# Altium project PCB_3U_Kasli.PrjPCB (part 1 of 7)
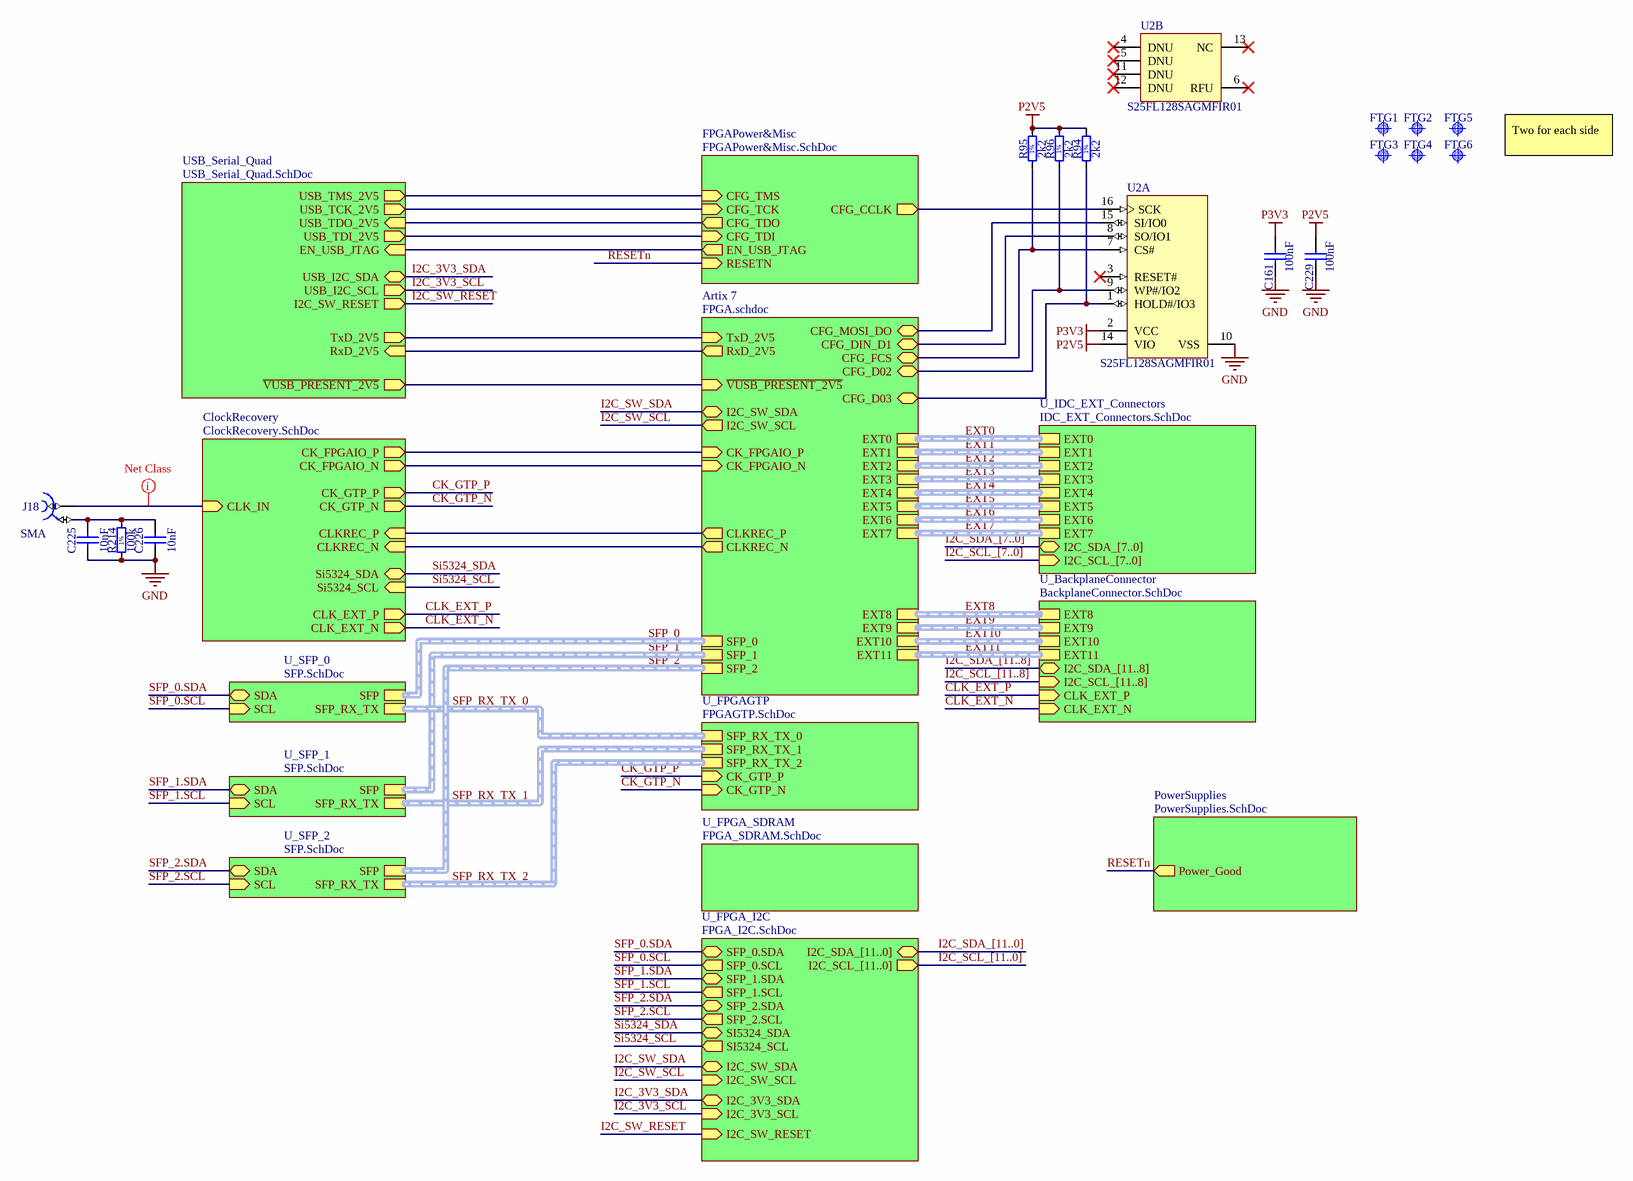
[diagram p0: TOP.SchDoc]
12 sheets, 669 parts. Net scope: hierarchical (ports join the sheet entries above them; power ports are global).
Board file: PCB_Kasli.PCBDOC
Sheets:
  TOP.SchDoc
    Artix 7 = FPGA.schdoc
    ClockRecovery = ClockRecovery.SchDoc
    PowerSupplies = PowerSupplies.SchDoc
    U_SFP_0 = SFP.SchDoc
    U_SFP_1 = SFP.SchDoc
    U_SFP_2 = SFP.SchDoc
    U_BackplaneConnector = BackplaneConnector.SchDoc
    FPGAPower&Misc = FPGAPower&Misc.SchDoc
    U_FPGAGTP = FPGAGTP.SchDoc
    U_FPGA_I2C = FPGA_I2C.SchDoc
    U_FPGA_SDRAM = FPGA_SDRAM.SchDoc
    U_IDC_EXT_Connectors = IDC_EXT_Connectors.SchDoc
    USB_Serial_Quad = USB_Serial_Quad.SchDoc

## Sheet TOP.SchDoc: =ProjectName
size 420 x 297 mm; Author: G.K.; CompanyName: WUT; DrawnBy: P.K.; Organization: WUT ISE; Address1: Warsaw Univeristy of Technology; Address2: Nowowiejska 15/19; DocumentNumber: 1; Revision: 1.0; SheetNumber: 1; SheetTotal: 12; EDA_Number: ARTIQ; Projet: ARTIQ/SINARA; ModifiedBy: -; CreateDate: XX/XX/XXXX; CheckedDate: -; Title2: TOP.SchDoc; DivGrp: ISE; Designer: G.K. and P.K.; ModifiedDate: -; ProjectName: ARTIQ/SINARA

### Parts
C161  100nF  [CAPC0603X33N]
C225  10nF  [CAPC1005X55N]
C226  10nF  [CAPC1005X55N]
C229  100nF  [CAPC0603X33N]
FTG1  Use only in PCB  [FIDUCIAL_TOP_C100-200]  (value not drawn)
FTG2  Use only in PCB  [FIDUCIAL_TOP_S100-200]  (value not drawn)
FTG3  Use only in PCB  [FIDUCIAL_TOP_C100-200]  (value not drawn)
FTG4  Use only in PCB  [FIDUCIAL_TOP_C100-200]  (value not drawn)
FTG5  Use only in PCB  [FIDUCIAL_TOP_C100-200]  (value not drawn)
FTG6  Use only in PCB  [FIDUCIAL_TOP_S100-200]  (value not drawn)
J18  SMA  [AMPHENOL_132203]
R94  2k2  [RESC1005X40N]
R95  2k2  [RESC1005X40N]
R96  2k2  [RESC1005X40N]
R214  100k  [RESC1005X40N]
U2  S25FL128SAGMFIR01  [SPSN-SOIC-16_N]  (parts A,B of 2)

### Sub-sheets
Artix 7 = FPGA.schdoc: EXT1 (harness ExtensionConnector), EXT2 (harness ExtensionConnector), EXT0 (harness ExtensionConnector), EXT3 (harness ExtensionConnector), EXT4 (harness ExtensionConnector), EXT5 (harness ExtensionConnector), EXT6 (harness ExtensionConnector), EXT7 (harness ExtensionConnector), EXT8 (harness ExtensionConnector), EXT9 (harness ExtensionConnector), EXT10 (harness ExtensionConnector), EXT11 (harness ExtensionConnector), CLKREC_P (out), CLKREC_N (out), CK_FPGAIO_P (in), CK_FPGAIO_N (in), SFP_0 (harness SFP), SFP_2 (harness SFP), SFP_1 (harness SFP), I2C_SW_SDA (bidir), I2C_SW_SCL (out), CFG_MOSI_DO (bidir), CFG_DIN_D1 (bidir), CFG_D02 (bidir), CFG_D03 (bidir), CFG_FCS (bidir), TxD_2V5 (in), RxD_2V5 (out), ~{VUSB_PRESENT_2V5} (in)
ClockRecovery = ClockRecovery.SchDoc: CLKREC_P (in), CLKREC_N (in), Si5324_SDA (bidir), Si5324_SCL (in), CK_GTP_P (out), CK_GTP_N (out), CK_FPGAIO_P (out), CK_FPGAIO_N (out), CLK_IN (in), CLK_EXT_P (out), CLK_EXT_N (out)
FPGAPower&Misc = FPGAPower&Misc.SchDoc: RESETN (in), CFG_CCLK (out), CFG_TMS (in), CFG_TCK (in), CFG_TDO (out), CFG_TDI (in), EN_USB_JTAG (out)
PowerSupplies = PowerSupplies.SchDoc: Power_Good (out)
U_BackplaneConnector = BackplaneConnector.SchDoc: EXT8 (harness ExtensionConnector), EXT9 (harness ExtensionConnector), EXT10 (harness ExtensionConnector), EXT11 (harness ExtensionConnector), I2C_SDA_[11..8] (bidir), I2C_SCL_[11..8] (in), CLK_EXT_P (in), CLK_EXT_N (in)
U_FPGA_I2C = FPGA_I2C.SchDoc: I2C_SDA_[11..0] (bidir), SFP_2.SDA (bidir), SFP_1.SDA (bidir), SFP_0.SDA (bidir), I2C_SW_SDA (bidir), I2C_SCL_[11..0] (out), SFP_0.SCL (out), SFP_1.SCL (out), SFP_2.SCL (out), SI5324_SDA (bidir), SI5324_SCL (out), I2C_SW_SCL (in), I2C_3V3_SCL (in), I2C_3V3_SDA (bidir), I2C_SW_RESET (in)
U_FPGA_SDRAM = FPGA_SDRAM.SchDoc: no entries
U_FPGAGTP = FPGAGTP.SchDoc: SFP_RX_TX_0 (harness SFP_RX_TX), SFP_RX_TX_1 (harness SFP_RX_TX), SFP_RX_TX_2 (harness SFP_RX_TX), CK_GTP_P (in), CK_GTP_N (in)
U_IDC_EXT_Connectors = IDC_EXT_Connectors.SchDoc: I2C_SDA_[7..0] (bidir), I2C_SCL_[7..0] (in), EXT0 (harness ExtensionConnector), EXT4 (harness ExtensionConnector), EXT2 (harness ExtensionConnector), EXT1 (harness ExtensionConnector), EXT3 (harness ExtensionConnector), EXT7 (harness ExtensionConnector), EXT6 (harness ExtensionConnector), EXT5 (harness ExtensionConnector)
U_SFP_0 = SFP.SchDoc: SDA (bidir), SCL (in), SFP (harness SFP), SFP_RX_TX (harness SFP_RX_TX)
U_SFP_1 = SFP.SchDoc: SDA (bidir), SCL (in), SFP (harness SFP), SFP_RX_TX (harness SFP_RX_TX)
U_SFP_2 = SFP.SchDoc: SDA (bidir), SCL (in), SFP (harness SFP), SFP_RX_TX (harness SFP_RX_TX)
USB_Serial_Quad = USB_Serial_Quad.SchDoc: USB_TDO_2V5 (in), RxD_2V5 (in), USB_TMS_2V5 (out), USB_TDI_2V5 (out), USB_TCK_2V5 (out), TxD_2V5 (out), EN_USB_JTAG (in), USB_I2C_SCL (out), USB_I2C_SDA (bidir), ~{VUSB_PRESENT_2V5} (out), I2C_SW_RESET (out)

### Nets
GND: C161.1 C225.1 C226.1 C229.1 R214.1 U2.10(VSS)
P2V5: C229.2 R94.2 R95.2 R96.2 U2.14(VIO)
P3V3: C161.2 U2.2(VCC)
~{VUSB_PRESENT_2V5}: sheet Artix 7/~{VUSB_PRESENT_2V5}, sheet USB_Serial_Quad/~{VUSB_PRESENT_2V5}
CFG_CCLK: U2.16(SCK) ; sheet FPGAPower&Misc/CFG_CCLK
CFG_D02: R96.1 U2.9(WP#/IO2) ; sheet Artix 7/CFG_D02
CFG_D03: R94.1 U2.1(HOLD#/IO3) ; sheet Artix 7/CFG_D03
CFG_DIN: U2.8(SO/IO1) ; sheet Artix 7/CFG_DIN_D1
CFG_FCS: R95.1 U2.7(CS#) ; sheet Artix 7/CFG_FCS
CFG_MOSI: U2.15(SI/IO0) ; sheet Artix 7/CFG_MOSI_DO
CFG_TCK: sheet FPGAPower&Misc/CFG_TCK, sheet USB_Serial_Quad/USB_TCK_2V5
CFG_TDI: sheet FPGAPower&Misc/CFG_TDI, sheet USB_Serial_Quad/USB_TDI_2V5
CFG_TDO: sheet FPGAPower&Misc/CFG_TDO, sheet USB_Serial_Quad/USB_TDO_2V5
CFG_TMS: sheet FPGAPower&Misc/CFG_TMS, sheet USB_Serial_Quad/USB_TMS_2V5
CK_FPGAIO_N: sheet Artix 7/CK_FPGAIO_N, sheet ClockRecovery/CK_FPGAIO_N
CK_FPGAIO_P: sheet Artix 7/CK_FPGAIO_P, sheet ClockRecovery/CK_FPGAIO_P
CK_GTP_N: sheet ClockRecovery/CK_GTP_N, sheet U_FPGAGTP/CK_GTP_N
CK_GTP_P: sheet ClockRecovery/CK_GTP_P, sheet U_FPGAGTP/CK_GTP_P
CLK_EXT_N: sheet ClockRecovery/CLK_EXT_N, sheet U_BackplaneConnector/CLK_EXT_N
CLK_EXT_P: sheet ClockRecovery/CLK_EXT_P, sheet U_BackplaneConnector/CLK_EXT_P
CLKREC_N: sheet Artix 7/CLKREC_N, sheet ClockRecovery/CLKREC_N
CLKREC_P: sheet Artix 7/CLKREC_P, sheet ClockRecovery/CLKREC_P
I2C_3V3_SCL: sheet U_FPGA_I2C/I2C_3V3_SCL, sheet USB_Serial_Quad/USB_I2C_SCL
I2C_3V3_SDA: sheet U_FPGA_I2C/I2C_3V3_SDA, sheet USB_Serial_Quad/USB_I2C_SDA
I2C_SW_RESET: sheet U_FPGA_I2C/I2C_SW_RESET, sheet USB_Serial_Quad/I2C_SW_RESET
I2C_SW_SCL: sheet Artix 7/I2C_SW_SCL, sheet U_FPGA_I2C/I2C_SW_SCL
I2C_SW_SDA: sheet Artix 7/I2C_SW_SDA, sheet U_FPGA_I2C/I2C_SW_SDA
RESETn: sheet PowerSupplies/Power_Good, sheet FPGAPower&Misc/RESETN
RxD_2V5: sheet Artix 7/RxD_2V5, sheet USB_Serial_Quad/RxD_2V5
SFP_0.SCL: sheet U_SFP_0/SCL, sheet U_FPGA_I2C/SFP_0.SCL
SFP_0.SDA: sheet U_SFP_0/SDA, sheet U_FPGA_I2C/SFP_0.SDA
SFP_1.SCL: sheet U_SFP_1/SCL, sheet U_FPGA_I2C/SFP_1.SCL
SFP_1.SDA: sheet U_SFP_1/SDA, sheet U_FPGA_I2C/SFP_1.SDA
SFP_2.SCL: sheet U_SFP_2/SCL, sheet U_FPGA_I2C/SFP_2.SCL
SFP_2.SDA: sheet U_SFP_2/SDA, sheet U_FPGA_I2C/SFP_2.SDA
Si5324_SCL: sheet ClockRecovery/Si5324_SCL, sheet U_FPGA_I2C/SI5324_SCL
Si5324_SDA: sheet ClockRecovery/Si5324_SDA, sheet U_FPGA_I2C/SI5324_SDA
TxD_2V5: sheet Artix 7/TxD_2V5, sheet USB_Serial_Quad/TxD_2V5
NetC53_2: sheet FPGAPower&Misc/EN_USB_JTAG, sheet USB_Serial_Quad/EN_USB_JTAG
NetC225_2: C225.2 C226.2 J18.2 R214.2
NetC228_1: J18.1 ; sheet ClockRecovery/CLK_IN

Not connected (* = marked no-connect by the designer): U2 3(RESET#)* 4(DNU)* 5(DNU)* 6(RFU)* 11(DNU)* 12(DNU)* 13(NC)*

### Buses and harness runs
bus I2C_SCL_[7..0] = sheet U_IDC_EXT_Connectors/I2C_SCL_[7..0]
bus I2C_SCL_[11..0] = sheet U_FPGA_I2C/I2C_SCL_[11..0]
bus I2C_SCL_[11..8] = sheet U_BackplaneConnector/I2C_SCL_[11..8]
bus I2C_SDA_[7..0] = sheet U_IDC_EXT_Connectors/I2C_SDA_[7..0]
bus I2C_SDA_[11..0] = sheet U_FPGA_I2C/I2C_SDA_[11..0]
bus I2C_SDA_[11..8] = sheet U_BackplaneConnector/I2C_SDA_[11..8]
harness EXT0 = sheet Artix 7/EXT0 = sheet U_IDC_EXT_Connectors/EXT0
harness EXT1 = sheet Artix 7/EXT1 = sheet U_IDC_EXT_Connectors/EXT1
harness EXT2 = sheet Artix 7/EXT2 = sheet U_IDC_EXT_Connectors/EXT2
harness EXT3 = sheet Artix 7/EXT3 = sheet U_IDC_EXT_Connectors/EXT3
harness EXT4 = sheet Artix 7/EXT4 = sheet U_IDC_EXT_Connectors/EXT4
harness EXT5 = sheet Artix 7/EXT5 = sheet U_IDC_EXT_Connectors/EXT5
harness EXT6 = sheet Artix 7/EXT6 = sheet U_IDC_EXT_Connectors/EXT6
harness EXT7 = sheet Artix 7/EXT7 = sheet U_IDC_EXT_Connectors/EXT7
harness EXT8 = sheet Artix 7/EXT8 = sheet U_BackplaneConnector/EXT8
harness EXT9 = sheet Artix 7/EXT9 = sheet U_BackplaneConnector/EXT9
harness EXT10 = sheet Artix 7/EXT10 = sheet U_BackplaneConnector/EXT10
harness EXT11 = sheet Artix 7/EXT11 = sheet U_BackplaneConnector/EXT11
harness SFP_0 = sheet Artix 7/SFP_0 = sheet U_SFP_0/SFP
harness SFP_1 = sheet Artix 7/SFP_1 = sheet U_SFP_1/SFP
harness SFP_2 = sheet Artix 7/SFP_2 = sheet U_SFP_2/SFP
harness SFP_RX_TX_0 = sheet U_FPGAGTP/SFP_RX_TX_0 = sheet U_SFP_0/SFP_RX_TX
harness SFP_RX_TX_1 = sheet U_FPGAGTP/SFP_RX_TX_1 = sheet U_SFP_1/SFP_RX_TX
harness SFP_RX_TX_2 = sheet U_FPGAGTP/SFP_RX_TX_2 = sheet U_SFP_2/SFP_RX_TX

### Layout directives
net class 50Ohm: NetC228_1

### Notes on the sheet
- Two for each side
- Project/Equipment
- Document
- Designer
- Drawn by
- Check.by
- File
- Last Mod.
- Print Date
- Sheet
- Size
- A3
- of
- Rev
- (in symbol R0402_2K2_1%_0.0625W_100PPM) 1%
- (in symbol R0402_100K_1%_0.0625W_100PPM) 1%

### Library data of the parts
C161 C229 = CC0201_100NF_6.3V_10%_X5R: Non-polarised capacitor; Part Description: SMD Multilayer Chip Ceramic Capacitor; Manufacturer: GENERIC; Manufacturer1 Part Number: 02016D104KAT2A; Voltage: 6.3V; TC: X5R; Tolerance: ±10%; Part Number: CC0201_100NF_6.3V_10%_X5R; Component Kind: Standard; Component Type: Standard; Pin Count: 2; Value: 100nF; Status: Not Recommended; Manufacturer Part Number: CC0201_100NF_6.3V_10%_X5R; Case: 0201; Mounted: Yes; Socket: No; SMD: Yes; Sense: No; Manufacturer1 Example: AVX; Manufacturer1 ComponentHeight: 0.33mm; HelpURL: \\cern.ch\dfs\Applications\Altium\Datasheets\CC0201_X5R_AVX.pdf; Author: CERN DEM JLC; CreateDate: 03.12.2007; LatestRevisionDate: 03.12.2007; ClassName: Artix
C225 C226 = CC0402_10NF_16V_10%_X7R: Non-polarised capacitor; Part Description: SMD Multilayer Chip Ceramic Capacitor; Manufacturer: GENERIC; Manufacturer1 Part Number: 223878715636; Voltage: 16V; TC: X7R; Tolerance: ±10%; Part Number: CC0402_10NF_16V_10%_X7R; Component Kind: Standard; Component Type: Standard; Pin Count: 2; Value: 10nF; Status: Not Recommended; Manufacturer Part Number: CC0402_10NF_16V_10%_X7R; Case: 0402; Mounted: Yes; Socket: No; SMD: Yes; Sense: No; Manufacturer1 Example: PHYCOMP; Manufacturer1 ComponentHeight: 0.55mm; HelpURL: \\cern.ch\dfs\Applications\Altium\Datasheets\CC0402_X7R_PHYCOMP.pdf; Author: CERN DEM JLC; CreateDate: 03.12.2007; LatestRevisionDate: 03.12.2007
FTG1 FTG3-FTG5 = FIDUCIAL_TARGET_C100-200: Fiducial Target; Part Description: Round Fiducial Target, Top Layer, 1.0mm, Top Solder 2.0mm, Keepout =2.0mm; Mounted: No; Part Number: FIDUCIAL_TARGET_C100-200; Component Kind: Standard (No BOM); Component Type: Standard (No BOM); Pin Count: 1; Family: Fiducial; Socket: No; SMD: Yes; Sense: No; Status: None; ComponentHeight: 0mm; HelpURL: Undefined; Author: CERN DEM JLC; CreateDate: 09.02.2010; LatestRevisionDate: 04.04.2012; PackageDescription: Round Fiducial Target, Top Layer, 1.0mm, Top Solder 2.0mm, Keepout =2.0mm
FTG2 FTG6 = FIDUCIAL_TARGET_S100-200: Fiducial Target; Part Description: Square Fiducial Target, Top Layer, 1.0mm, Top Solder 2.0mm, Keepout =2.0mm; Mounted: No; Part Number: FIDUCIAL_TARGET_S100-200; Component Kind: Standard (No BOM); Component Type: Standard (No BOM); Pin Count: 1; Family: Fiducial; Socket: No; SMD: Yes; Sense: No; Status: None; ComponentHeight: 0mm; HelpURL: Undefined; Author: CERN DEM JLC; CreateDate: 09.02.2010; LatestRevisionDate: 04.04.2012; PackageDescription: Square Fiducial Target, Top Layer, 1.0mm, Top Solder 2.0mm, Keepout =2.0mm
J18 = AMPHENOL_132203: Part Description: 50 Ohm Through Hole SMA Right Angle PCB Jack; Manufacturer Part Number: 132203; PressFit: No; Part Number: AMPHENOL_132203; Component Kind: Standard; Component Type: Standard; Pin Count: 5; Family: SMA; Mounted: Yes; Socket: No; SMD: No; Sense: No; Status: None; Manufacturer: AMPHENOL; ComponentHeight: 10.44mm; HelpURL: \\cern.ch\dfs\Applications\Altium\Datasheets\AMPHENOL_132203.pdf; Author: CERN DEM MR; CreateDate: 2016-10-06; LatestRevisionDate: 2016-10-06; ClassName: Connectors
R94-R96 = R0402_2K2_1%_0.0625W_100PPM: Resistor - 1%; Part Description: General Purpose Thick Film Chip Resistor; Manufacturer: GENERIC; Manufacturer1 Part Number: 232270672202L; TC: ±100ppm/°C; PressFit: No; Part Number: R0402_2K2_1%_0.0625W_100PPM; Component Kind: Standard; Component Type: Standard; Pin Count: 2; Value: 2k2; Status: Not Recommended; Power: 0.0625W; Tolerance: ±1%; Manufacturer Part Number: R0402_2K2_1%_0.0625W_100PPM; Case: 0402; Mounted: Yes; Sense: No; Socket: No; SMD: Yes; Manufacturer1 Example: YAGEO PHYCOMP; Manufacturer1 ComponentHeight: 0.4mm; HelpURL: \\cern.ch\dfs\Applications\Altium\Datasheets\R0402_Phycomp_RC0402.pdf; Author: CERN DEM JLC; CreateDate: 03.12.2007; LatestRevisionDate: 17.10.2012; ClassName: Artix
R214 = R0402_100K_1%_0.0625W_100PPM: Resistor - 1%; Part Description: General Purpose Thick Film Chip Resistor; Manufacturer: GENERIC; Manufacturer1 Part Number: 232270671004L; PressFit: No; TC: ±100ppm/°C; Part Number: R0402_100K_1%_0.0625W_100PPM; Component Kind: Standard; Component Type: Standard; Pin Count: 2; Value: 100k; Status: Not Recommended; Manufacturer Part Number: R0402_100K_1%_0.0625W_100PPM; Case: 0402; Mounted: Yes; Sense: No; Socket: No; SMD: Yes; Manufacturer1 Example: YAGEO PHYCOMP; Manufacturer1 ComponentHeight: 0.4mm; HelpURL: \\cern.ch\dfs\Applications\Altium\Datasheets\R0402_Phycomp_RC0402.pdf; Author: CERN DEM JLC; CreateDate: 03.12.2007; LatestRevisionDate: 17.10.2012; Power: 0.0625W; Tolerance: ±1%
U2 = CMP-1329-00021-1: MirrorBit Flash Non-Volatile Memory CMOS 3.0 Volt Core with Versatile I/O, Serial Peripheral Interface with Multi-I/O, 128 Mbit, 133 MHz, -40 to 85 degC, 16-Pin SO (SO3016), RoHS, Tube; Manufacturer: Spansion; OTP: 1024 B; VCC: 2.7 to 3.6 V; Speed: 133 MHz; PackageDescription: 16-Pin Wide Plastic Small Outline Package, Body 10.3 x 7.5 mm, Pitch 1.27 mm; ComponentLink2URL: http://www.spansion.com/Support/Datasheets/S25FL128S_256S_00.pdf; PartNumber: S25FL128SAGMFIR01; Packing: Tube; Density: 128 Mbit; Temperature Range: -40 to 85 degC; Mounting Technology: Surface Mount; RoHS: TRUE; DatasheetVersion: Rev. 08; ComponentLink2Description: Datasheet; ComponentLink3URL: http://www.spansion.com/Support/Datasheets/S25FL128S_256S_00.pdf; ComponentLink1Description: Manufacturer URL; ComponentLink1URL: http://www.spansion.com/Pages/Default.aspx; ComponentLink3Description: Package Specification

## Sheet FPGA.schdoc: =ProjectName
size 420 x 297 mm; Author: P.K.; CompanyName: WUT; DrawnBy: P.K.; Organization: WUT ISE; Address1: Warsaw Univeristy of Technology; Address2: Nowowiejska 15/19; DocumentNumber: 2; Revision: 1.1; SheetNumber: 2; SheetTotal: 12; EDA_Number: ARTIQ; Projet: ARTIQ/SINARA; ModifiedBy: -; CreateDate: XX/XX/XXXX; CheckedDate: -; Title2: FPGA.schdoc; DivGrp: ISE; Designer: P.K.; ModifiedDate: -; ProjectName: ARTIQ/SINARA
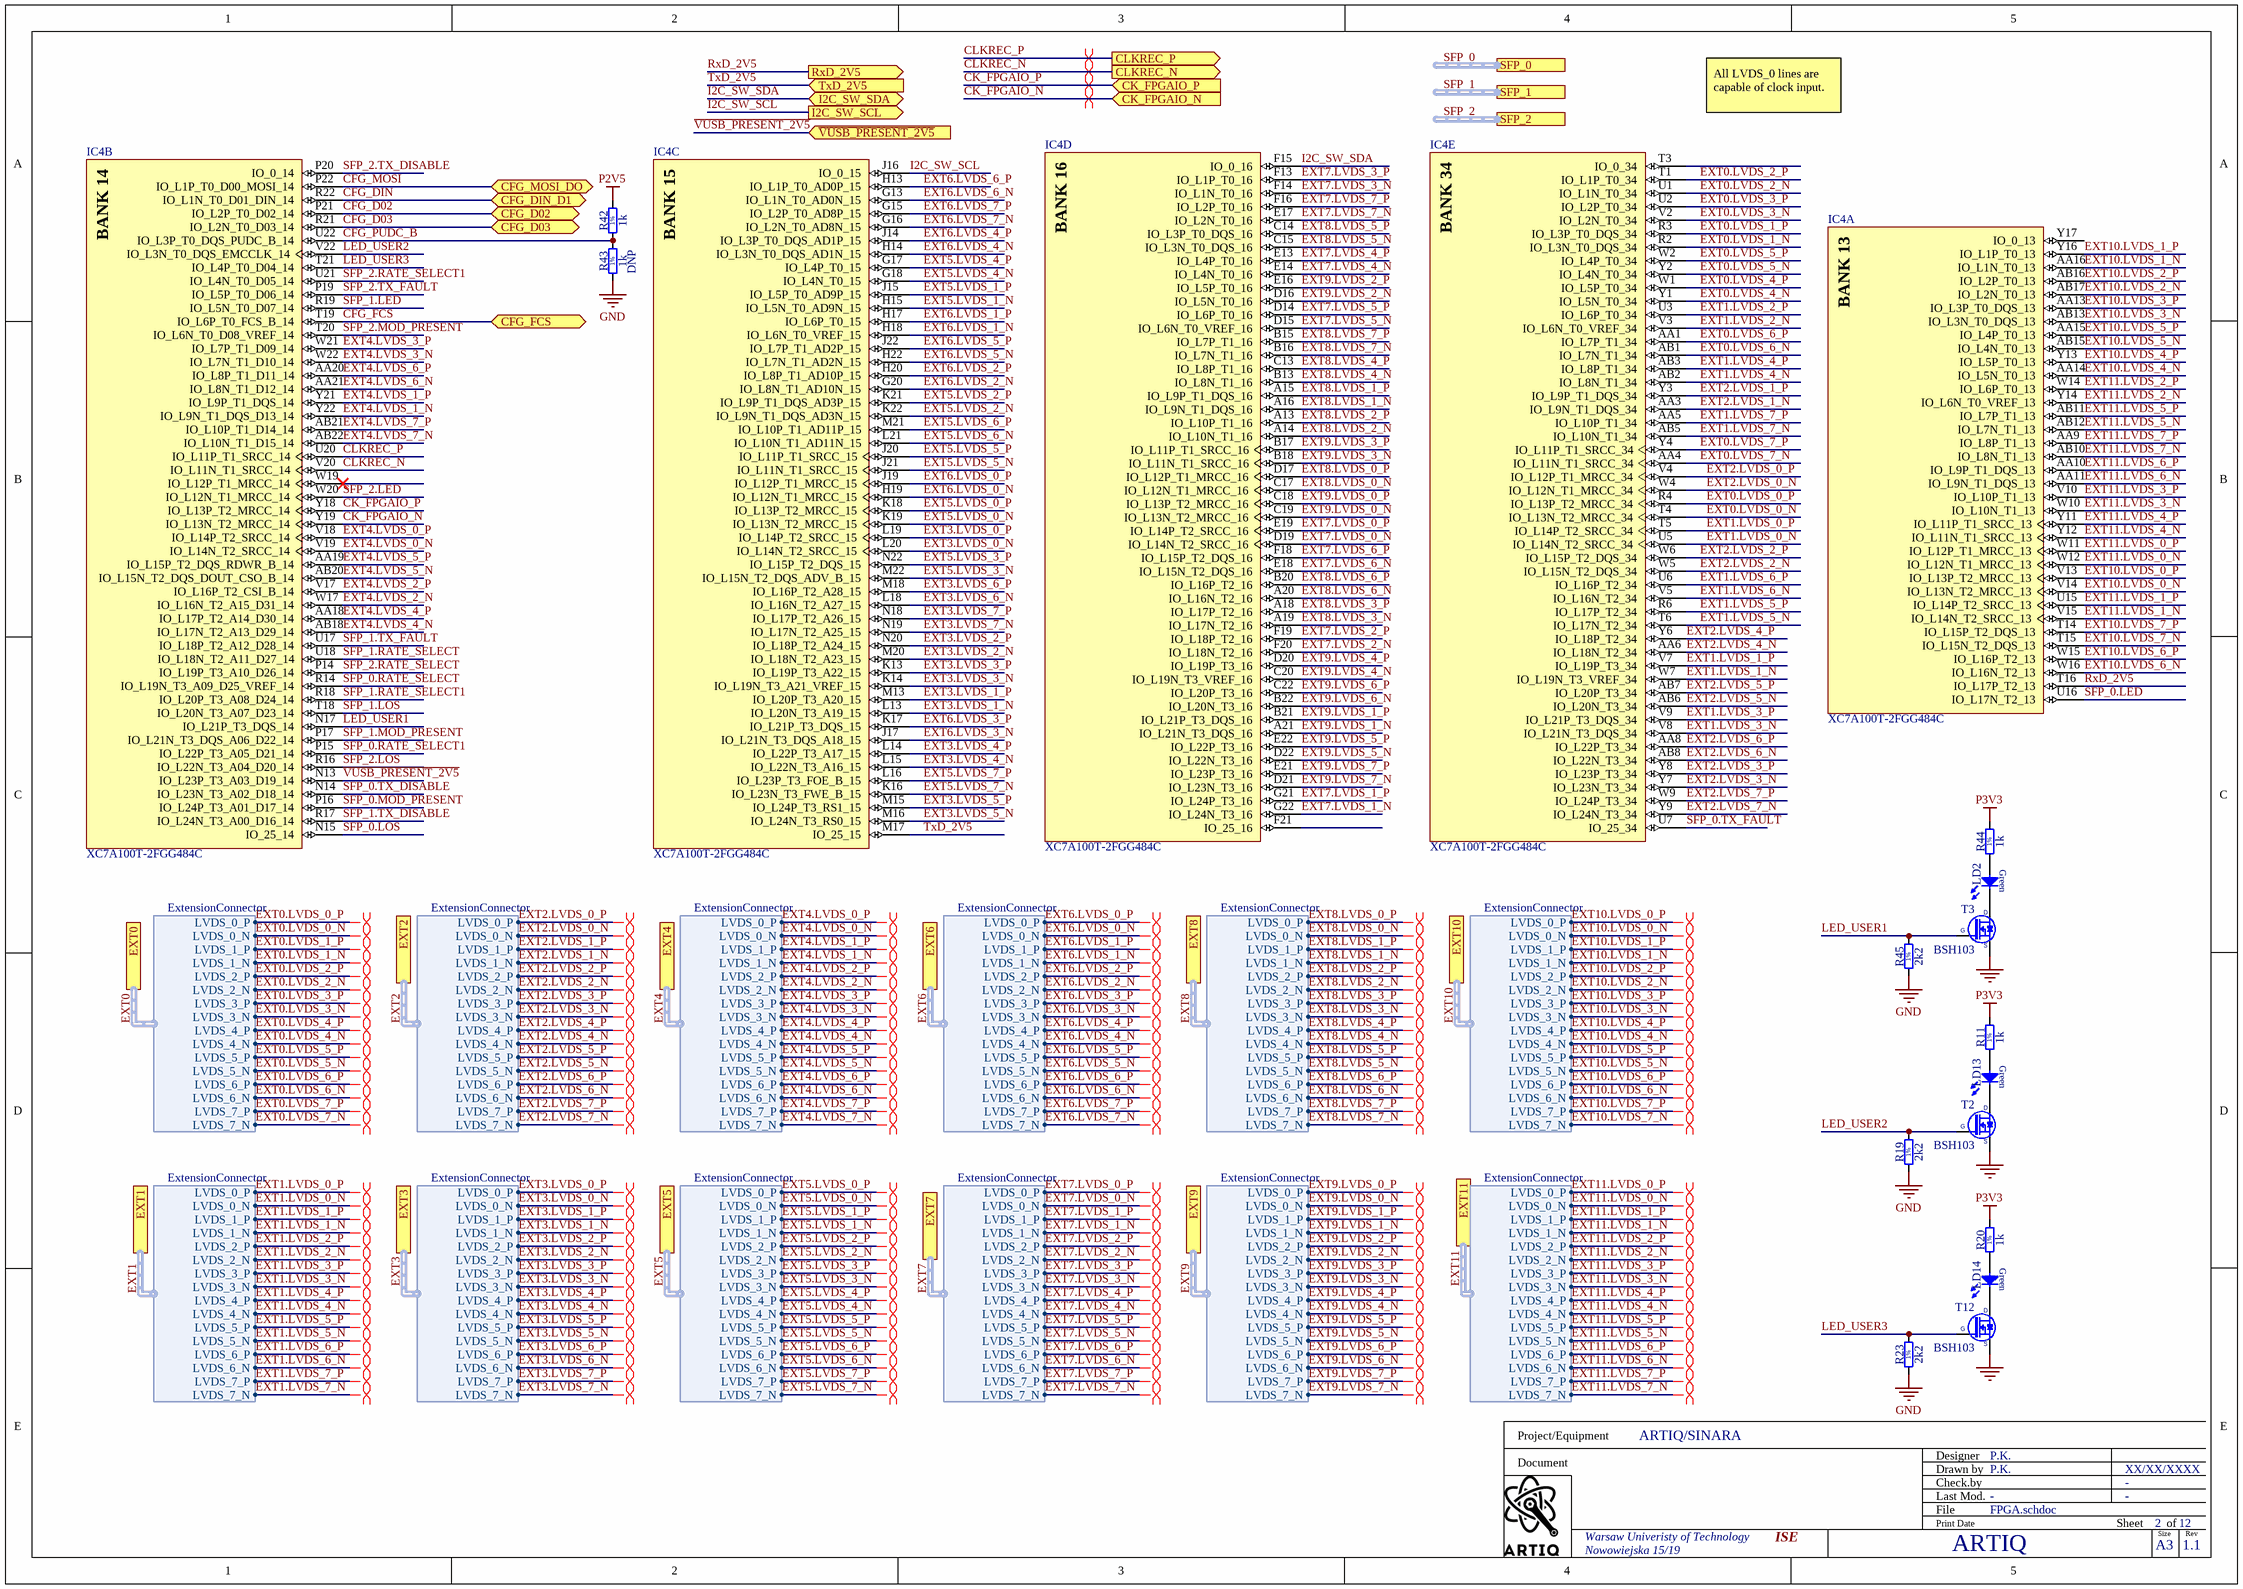
[diagram p1: FPGA.schdoc]

### Parts
IC4  XC7A100T-2FGG484C  [FGG484]  (parts A,B,C,D,E of 10)
LD2  (no value)  [LED_KINGBRIGHT_KPH-1608CGCK]
LD13  (no value)  [LED_KINGBRIGHT_KPH-1608CGCK]
LD14  (no value)  [LED_KINGBRIGHT_KPH-1608CGCK]
R11  1k  [RESC1005X40N]
R19  2k2  [RESC1005X40N]
R20  1k  [RESC1005X40N]
R23  2k2  [RESC1005X40N]
R42  1k  [RESC1005X40N]
R43  1k  [RESC1005X40N]
R44  1k  [RESC1005X40N]
R45  2k2  [RESC1005X40N]
T2  BSH103  [SOT95P230X110-3N]
T3  BSH103  [SOT95P230X110-3N]
T12  BSH103  [SOT95P230X110-3N]

### Ports
CFG_D02 (bidir), CFG_D03 (bidir), CFG_DIN_D1 (bidir), CFG_FCS (bidir), CFG_MOSI_DO (bidir), CK_FPGAIO_N (in), CK_FPGAIO_P (in), CLKREC_N (out), CLKREC_P (out), EXT0 (harness ExtensionConnector), EXT1 (harness ExtensionConnector), EXT2 (harness ExtensionConnector), EXT3 (harness ExtensionConnector), EXT4 (harness ExtensionConnector), EXT5 (harness ExtensionConnector), EXT6 (harness ExtensionConnector), EXT7 (harness ExtensionConnector), EXT8 (harness ExtensionConnector), EXT9 (harness ExtensionConnector), EXT10 (harness ExtensionConnector), EXT11 (harness ExtensionConnector), I2C_SW_SCL (out), I2C_SW_SDA (bidir), RxD_2V5 (out), SFP_0 (harness SFP), SFP_1 (harness SFP), SFP_2 (harness SFP), TxD_2V5 (in), ~{VUSB_PRESENT_2V5} (in)

### Harnesses
ExtensionConnector: LVDS_0_N, LVDS_0_P, LVDS_1_N, LVDS_1_P, LVDS_2_N, LVDS_2_P, LVDS_3_N, LVDS_3_P, LVDS_4_N, LVDS_4_P, LVDS_5_N, LVDS_5_P, LVDS_6_N, LVDS_6_P, LVDS_7_N, LVDS_7_P

### Nets
GND: R19.1 R23.1 R43.1 R45.1 T2.2(S) T3.2(S) T12.2(S)
P2V5: R42.2
P3V3: R11.2 R20.2 R44.2
~{VUSB_PRESENT_2V5}: IC4.N13(IO_L23P_T3_A03_D19_14) ; port ~{VUSB_PRESENT_2V5}
CFG_D02: IC4.P21(IO_L2P_T0_D02_14) ; port CFG_D02
CFG_D03: IC4.R21(IO_L2N_T0_D03_14) ; port CFG_D03
CFG_DIN: IC4.R22(IO_L1N_T0_D01_DIN_14) ; port CFG_DIN_D1
CFG_FCS: IC4.T19(IO_L6P_T0_FCS_B_14) ; port CFG_FCS
CFG_MOSI: IC4.P22(IO_L1P_T0_D00_MOSI_14) ; port CFG_MOSI_DO
CFG_PUDC_B: IC4.U22(IO_L3P_T0_DQS_PUDC_B_14) R42.1 R43.2
CK_FPGAIO_N: IC4.Y19(IO_L13N_T2_MRCC_14) ; port CK_FPGAIO_N
CK_FPGAIO_P: IC4.Y18(IO_L13P_T2_MRCC_14) ; port CK_FPGAIO_P
CLKREC_N: IC4.V20(IO_L11N_T1_SRCC_14) ; port CLKREC_N
CLKREC_P: IC4.U20(IO_L11P_T1_SRCC_14) ; port CLKREC_P
EXT0.LVDS_0_N: IC4.T4(IO_L13N_T2_MRCC_34) ; port EXT0.LVDS_0_N
EXT0.LVDS_0_P: IC4.R4(IO_L13P_T2_MRCC_34) ; port EXT0.LVDS_0_P
EXT0.LVDS_1_N: IC4.R2(IO_L3N_T0_DQS_34) ; port EXT0.LVDS_1_N
EXT0.LVDS_1_P: IC4.R3(IO_L3P_T0_DQS_34) ; port EXT0.LVDS_1_P
EXT0.LVDS_2_N: IC4.U1(IO_L1N_T0_34) ; port EXT0.LVDS_2_N
EXT0.LVDS_2_P: IC4.T1(IO_L1P_T0_34) ; port EXT0.LVDS_2_P
EXT0.LVDS_3_N: IC4.V2(IO_L2N_T0_34) ; port EXT0.LVDS_3_N
EXT0.LVDS_3_P: IC4.U2(IO_L2P_T0_34) ; port EXT0.LVDS_3_P
EXT0.LVDS_4_N: IC4.Y1(IO_L5N_T0_34) ; port EXT0.LVDS_4_N
EXT0.LVDS_4_P: IC4.W1(IO_L5P_T0_34) ; port EXT0.LVDS_4_P
EXT0.LVDS_5_N: IC4.Y2(IO_L4N_T0_34) ; port EXT0.LVDS_5_N
EXT0.LVDS_5_P: IC4.W2(IO_L4P_T0_34) ; port EXT0.LVDS_5_P
EXT0.LVDS_6_N: IC4.AB1(IO_L7N_T1_34) ; port EXT0.LVDS_6_N
EXT0.LVDS_6_P: IC4.AA1(IO_L7P_T1_34) ; port EXT0.LVDS_6_P
EXT0.LVDS_7_N: IC4.AA4(IO_L11N_T1_SRCC_34) ; port EXT0.LVDS_7_N
EXT0.LVDS_7_P: IC4.Y4(IO_L11P_T1_SRCC_34) ; port EXT0.LVDS_7_P
EXT1.LVDS_0_N: IC4.U5(IO_L14N_T2_SRCC_34) ; port EXT1.LVDS_0_N
EXT1.LVDS_0_P: IC4.T5(IO_L14P_T2_SRCC_34) ; port EXT1.LVDS_0_P
EXT1.LVDS_1_N: IC4.W7(IO_L19N_T3_VREF_34) ; port EXT1.LVDS_1_N
EXT1.LVDS_1_P: IC4.V7(IO_L19P_T3_34) ; port EXT1.LVDS_1_P
EXT1.LVDS_2_N: IC4.V3(IO_L6N_T0_VREF_34) ; port EXT1.LVDS_2_N
EXT1.LVDS_2_P: IC4.U3(IO_L6P_T0_34) ; port EXT1.LVDS_2_P
EXT1.LVDS_3_N: IC4.V8(IO_L21N_T3_DQS_34) ; port EXT1.LVDS_3_N
EXT1.LVDS_3_P: IC4.V9(IO_L21P_T3_DQS_34) ; port EXT1.LVDS_3_P
EXT1.LVDS_4_N: IC4.AB2(IO_L8N_T1_34) ; port EXT1.LVDS_4_N
EXT1.LVDS_4_P: IC4.AB3(IO_L8P_T1_34) ; port EXT1.LVDS_4_P
EXT1.LVDS_5_N: IC4.T6(IO_L17N_T2_34) ; port EXT1.LVDS_5_N
EXT1.LVDS_5_P: IC4.R6(IO_L17P_T2_34) ; port EXT1.LVDS_5_P
EXT1.LVDS_6_N: IC4.V5(IO_L16N_T2_34) ; port EXT1.LVDS_6_N
EXT1.LVDS_6_P: IC4.U6(IO_L16P_T2_34) ; port EXT1.LVDS_6_P
EXT1.LVDS_7_N: IC4.AB5(IO_L10N_T1_34) ; port EXT1.LVDS_7_N
EXT1.LVDS_7_P: IC4.AA5(IO_L10P_T1_34) ; port EXT1.LVDS_7_P
EXT2.LVDS_0_N: IC4.W4(IO_L12N_T1_MRCC_34) ; port EXT2.LVDS_0_N
EXT2.LVDS_0_P: IC4.V4(IO_L12P_T1_MRCC_34) ; port EXT2.LVDS_0_P
EXT2.LVDS_1_N: IC4.AA3(IO_L9N_T1_DQS_34) ; port EXT2.LVDS_1_N
EXT2.LVDS_1_P: IC4.Y3(IO_L9P_T1_DQS_34) ; port EXT2.LVDS_1_P
EXT2.LVDS_2_N: IC4.W5(IO_L15N_T2_DQS_34) ; port EXT2.LVDS_2_N
EXT2.LVDS_2_P: IC4.W6(IO_L15P_T2_DQS_34) ; port EXT2.LVDS_2_P
EXT2.LVDS_3_N: IC4.Y7(IO_L23N_T3_34) ; port EXT2.LVDS_3_N
EXT2.LVDS_3_P: IC4.Y8(IO_L23P_T3_34) ; port EXT2.LVDS_3_P
EXT2.LVDS_4_N: IC4.AA6(IO_L18N_T2_34) ; port EXT2.LVDS_4_N
EXT2.LVDS_4_P: IC4.Y6(IO_L18P_T2_34) ; port EXT2.LVDS_4_P
EXT2.LVDS_5_N: IC4.AB6(IO_L20N_T3_34) ; port EXT2.LVDS_5_N
EXT2.LVDS_5_P: IC4.AB7(IO_L20P_T3_34) ; port EXT2.LVDS_5_P
EXT2.LVDS_6_N: IC4.AB8(IO_L22N_T3_34) ; port EXT2.LVDS_6_N
EXT2.LVDS_6_P: IC4.AA8(IO_L22P_T3_34) ; port EXT2.LVDS_6_P
EXT2.LVDS_7_N: IC4.Y9(IO_L24N_T3_34) ; port EXT2.LVDS_7_N
EXT2.LVDS_7_P: IC4.W9(IO_L24P_T3_34) ; port EXT2.LVDS_7_P
EXT3.LVDS_0_N: IC4.L20(IO_L14N_T2_SRCC_15) ; port EXT3.LVDS_0_N
EXT3.LVDS_0_P: IC4.L19(IO_L14P_T2_SRCC_15) ; port EXT3.LVDS_0_P
EXT3.LVDS_1_N: IC4.L13(IO_L20N_T3_A19_15) ; port EXT3.LVDS_1_N
EXT3.LVDS_1_P: IC4.M13(IO_L20P_T3_A20_15) ; port EXT3.LVDS_1_P
EXT3.LVDS_2_N: IC4.M20(IO_L18N_T2_A23_15) ; port EXT3.LVDS_2_N
EXT3.LVDS_2_P: IC4.N20(IO_L18P_T2_A24_15) ; port EXT3.LVDS_2_P
EXT3.LVDS_3_N: IC4.K14(IO_L19N_T3_A21_VREF_15) ; port EXT3.LVDS_3_N
EXT3.LVDS_3_P: IC4.K13(IO_L19P_T3_A22_15) ; port EXT3.LVDS_3_P
EXT3.LVDS_4_N: IC4.L15(IO_L22N_T3_A16_15) ; port EXT3.LVDS_4_N
EXT3.LVDS_4_P: IC4.L14(IO_L22P_T3_A17_15) ; port EXT3.LVDS_4_P
EXT3.LVDS_5_N: IC4.M16(IO_L24N_T3_RS0_15) ; port EXT3.LVDS_5_N
EXT3.LVDS_5_P: IC4.M15(IO_L24P_T3_RS1_15) ; port EXT3.LVDS_5_P
EXT3.LVDS_6_N: IC4.L18(IO_L16N_T2_A27_15) ; port EXT3.LVDS_6_N
EXT3.LVDS_6_P: IC4.M18(IO_L16P_T2_A28_15) ; port EXT3.LVDS_6_P
EXT3.LVDS_7_N: IC4.N19(IO_L17N_T2_A25_15) ; port EXT3.LVDS_7_N
EXT3.LVDS_7_P: IC4.N18(IO_L17P_T2_A26_15) ; port EXT3.LVDS_7_P
EXT4.LVDS_0_N: IC4.V19(IO_L14N_T2_SRCC_14) ; port EXT4.LVDS_0_N
EXT4.LVDS_0_P: IC4.V18(IO_L14P_T2_SRCC_14) ; port EXT4.LVDS_0_P
EXT4.LVDS_1_N: IC4.Y22(IO_L9N_T1_DQS_D13_14) ; port EXT4.LVDS_1_N
EXT4.LVDS_1_P: IC4.Y21(IO_L9P_T1_DQS_14) ; port EXT4.LVDS_1_P
EXT4.LVDS_2_N: IC4.W17(IO_L16N_T2_A15_D31_14) ; port EXT4.LVDS_2_N
EXT4.LVDS_2_P: IC4.V17(IO_L16P_T2_CSI_B_14) ; port EXT4.LVDS_2_P
EXT4.LVDS_3_N: IC4.W22(IO_L7N_T1_D10_14) ; port EXT4.LVDS_3_N
EXT4.LVDS_3_P: IC4.W21(IO_L7P_T1_D09_14) ; port EXT4.LVDS_3_P
EXT4.LVDS_4_N: IC4.AB18(IO_L17N_T2_A13_D29_14) ; port EXT4.LVDS_4_N
EXT4.LVDS_4_P: IC4.AA18(IO_L17P_T2_A14_D30_14) ; port EXT4.LVDS_4_P
EXT4.LVDS_5_N: IC4.AB20(IO_L15N_T2_DQS_DOUT_CSO_B_14) ; port EXT4.LVDS_5_N
EXT4.LVDS_5_P: IC4.AA19(IO_L15P_T2_DQS_RDWR_B_14) ; port EXT4.LVDS_5_P
EXT4.LVDS_6_N: IC4.AA21(IO_L8N_T1_D12_14) ; port EXT4.LVDS_6_N
EXT4.LVDS_6_P: IC4.AA20(IO_L8P_T1_D11_14) ; port EXT4.LVDS_6_P
EXT4.LVDS_7_N: IC4.AB22(IO_L10N_T1_D15_14) ; port EXT4.LVDS_7_N
EXT4.LVDS_7_P: IC4.AB21(IO_L10P_T1_D14_14) ; port EXT4.LVDS_7_P
EXT5.LVDS_0_N: IC4.K19(IO_L13N_T2_MRCC_15) ; port EXT5.LVDS_0_N
EXT5.LVDS_0_P: IC4.K18(IO_L13P_T2_MRCC_15) ; port EXT5.LVDS_0_P
EXT5.LVDS_1_N: IC4.H15(IO_L5N_T0_AD9N_15) ; port EXT5.LVDS_1_N
EXT5.LVDS_1_P: IC4.J15(IO_L5P_T0_AD9P_15) ; port EXT5.LVDS_1_P
EXT5.LVDS_2_N: IC4.K22(IO_L9N_T1_DQS_AD3N_15) ; port EXT5.LVDS_2_N
EXT5.LVDS_2_P: IC4.K21(IO_L9P_T1_DQS_AD3P_15) ; port EXT5.LVDS_2_P
EXT5.LVDS_3_N: IC4.M22(IO_L15N_T2_DQS_ADV_B_15) ; port EXT5.LVDS_3_N
EXT5.LVDS_3_P: IC4.N22(IO_L15P_T2_DQS_15) ; port EXT5.LVDS_3_P
EXT5.LVDS_4_N: IC4.G18(IO_L4N_T0_15) ; port EXT5.LVDS_4_N
EXT5.LVDS_4_P: IC4.G17(IO_L4P_T0_15) ; port EXT5.LVDS_4_P
EXT5.LVDS_5_N: IC4.J21(IO_L11N_T1_SRCC_15) ; port EXT5.LVDS_5_N
EXT5.LVDS_5_P: IC4.J20(IO_L11P_T1_SRCC_15) ; port EXT5.LVDS_5_P
EXT5.LVDS_6_N: IC4.L21(IO_L10N_T1_AD11N_15) ; port EXT5.LVDS_6_N
EXT5.LVDS_6_P: IC4.M21(IO_L10P_T1_AD11P_15) ; port EXT5.LVDS_6_P
EXT5.LVDS_7_N: IC4.K16(IO_L23N_T3_FWE_B_15) ; port EXT5.LVDS_7_N
EXT5.LVDS_7_P: IC4.L16(IO_L23P_T3_FOE_B_15) ; port EXT5.LVDS_7_P
EXT6.LVDS_0_N: IC4.H19(IO_L12N_T1_MRCC_15) ; port EXT6.LVDS_0_N
EXT6.LVDS_0_P: IC4.J19(IO_L12P_T1_MRCC_15) ; port EXT6.LVDS_0_P
EXT6.LVDS_1_N: IC4.H18(IO_L6N_T0_VREF_15) ; port EXT6.LVDS_1_N
EXT6.LVDS_1_P: IC4.H17(IO_L6P_T0_15) ; port EXT6.LVDS_1_P
EXT6.LVDS_2_N: IC4.G20(IO_L8N_T1_AD10N_15) ; port EXT6.LVDS_2_N
EXT6.LVDS_2_P: IC4.H20(IO_L8P_T1_AD10P_15) ; port EXT6.LVDS_2_P
EXT6.LVDS_3_N: IC4.J17(IO_L21N_T3_DQS_A18_15) ; port EXT6.LVDS_3_N
EXT6.LVDS_3_P: IC4.K17(IO_L21P_T3_DQS_15) ; port EXT6.LVDS_3_P
EXT6.LVDS_4_N: IC4.H14(IO_L3N_T0_DQS_AD1N_15) ; port EXT6.LVDS_4_N
EXT6.LVDS_4_P: IC4.J14(IO_L3P_T0_DQS_AD1P_15) ; port EXT6.LVDS_4_P
EXT6.LVDS_5_N: IC4.H22(IO_L7N_T1_AD2N_15) ; port EXT6.LVDS_5_N
EXT6.LVDS_5_P: IC4.J22(IO_L7P_T1_AD2P_15) ; port EXT6.LVDS_5_P
EXT6.LVDS_6_N: IC4.G13(IO_L1N_T0_AD0N_15) ; port EXT6.LVDS_6_N
EXT6.LVDS_6_P: IC4.H13(IO_L1P_T0_AD0P_15) ; port EXT6.LVDS_6_P
EXT6.LVDS_7_N: IC4.G16(IO_L2N_T0_AD8N_15) ; port EXT6.LVDS_7_N
EXT6.LVDS_7_P: IC4.G15(IO_L2P_T0_AD8P_15) ; port EXT6.LVDS_7_P
EXT7.LVDS_0_N: IC4.D19(IO_L14N_T2_SRCC_16) ; port EXT7.LVDS_0_N
EXT7.LVDS_0_P: IC4.E19(IO_L14P_T2_SRCC_16) ; port EXT7.LVDS_0_P
EXT7.LVDS_1_N: IC4.G22(IO_L24N_T3_16) ; port EXT7.LVDS_1_N
EXT7.LVDS_1_P: IC4.G21(IO_L24P_T3_16) ; port EXT7.LVDS_1_P
EXT7.LVDS_2_N: IC4.F20(IO_L18N_T2_16) ; port EXT7.LVDS_2_N
EXT7.LVDS_2_P: IC4.F19(IO_L18P_T2_16) ; port EXT7.LVDS_2_P
EXT7.LVDS_3_N: IC4.F14(IO_L1N_T0_16) ; port EXT7.LVDS_3_N
EXT7.LVDS_3_P: IC4.F13(IO_L1P_T0_16) ; port EXT7.LVDS_3_P
EXT7.LVDS_4_N: IC4.E14(IO_L4N_T0_16) ; port EXT7.LVDS_4_N
EXT7.LVDS_4_P: IC4.E13(IO_L4P_T0_16) ; port EXT7.LVDS_4_P
EXT7.LVDS_5_N: IC4.D15(IO_L6N_T0_VREF_16) ; port EXT7.LVDS_5_N
EXT7.LVDS_5_P: IC4.D14(IO_L6P_T0_16) ; port EXT7.LVDS_5_P
EXT7.LVDS_6_N: IC4.E18(IO_L15N_T2_DQS_16) ; port EXT7.LVDS_6_N
EXT7.LVDS_6_P: IC4.F18(IO_L15P_T2_DQS_16) ; port EXT7.LVDS_6_P
EXT7.LVDS_7_N: IC4.E17(IO_L2N_T0_16) ; port EXT7.LVDS_7_N
EXT7.LVDS_7_P: IC4.F16(IO_L2P_T0_16) ; port EXT7.LVDS_7_P
EXT8.LVDS_0_N: IC4.C17(IO_L12N_T1_MRCC_16) ; port EXT8.LVDS_0_N
EXT8.LVDS_0_P: IC4.D17(IO_L12P_T1_MRCC_16) ; port EXT8.LVDS_0_P
EXT8.LVDS_1_N: IC4.A16(IO_L9N_T1_DQS_16) ; port EXT8.LVDS_1_N
EXT8.LVDS_1_P: IC4.A15(IO_L9P_T1_DQS_16) ; port EXT8.LVDS_1_P
EXT8.LVDS_2_N: IC4.A14(IO_L10N_T1_16) ; port EXT8.LVDS_2_N
EXT8.LVDS_2_P: IC4.A13(IO_L10P_T1_16) ; port EXT8.LVDS_2_P
EXT8.LVDS_3_N: IC4.A19(IO_L17N_T2_16) ; port EXT8.LVDS_3_N
EXT8.LVDS_3_P: IC4.A18(IO_L17P_T2_16) ; port EXT8.LVDS_3_P
EXT8.LVDS_4_N: IC4.B13(IO_L8N_T1_16) ; port EXT8.LVDS_4_N
EXT8.LVDS_4_P: IC4.C13(IO_L8P_T1_16) ; port EXT8.LVDS_4_P
EXT8.LVDS_5_N: IC4.C15(IO_L3N_T0_DQS_16) ; port EXT8.LVDS_5_N
EXT8.LVDS_5_P: IC4.C14(IO_L3P_T0_DQS_16) ; port EXT8.LVDS_5_P
EXT8.LVDS_6_N: IC4.A20(IO_L16N_T2_16) ; port EXT8.LVDS_6_N
EXT8.LVDS_6_P: IC4.B20(IO_L16P_T2_16) ; port EXT8.LVDS_6_P
EXT8.LVDS_7_N: IC4.B16(IO_L7N_T1_16) ; port EXT8.LVDS_7_N
EXT8.LVDS_7_P: IC4.B15(IO_L7P_T1_16) ; port EXT8.LVDS_7_P
EXT9.LVDS_0_N: IC4.C19(IO_L13N_T2_MRCC_16) ; port EXT9.LVDS_0_N
EXT9.LVDS_0_P: IC4.C18(IO_L13P_T2_MRCC_16) ; port EXT9.LVDS_0_P
EXT9.LVDS_1_N: IC4.A21(IO_L21N_T3_DQS_16) ; port EXT9.LVDS_1_N
EXT9.LVDS_1_P: IC4.B21(IO_L21P_T3_DQS_16) ; port EXT9.LVDS_1_P
EXT9.LVDS_2_N: IC4.D16(IO_L5N_T0_16) ; port EXT9.LVDS_2_N
EXT9.LVDS_2_P: IC4.E16(IO_L5P_T0_16) ; port EXT9.LVDS_2_P
EXT9.LVDS_3_N: IC4.B18(IO_L11N_T1_SRCC_16) ; port EXT9.LVDS_3_N
EXT9.LVDS_3_P: IC4.B17(IO_L11P_T1_SRCC_16) ; port EXT9.LVDS_3_P
EXT9.LVDS_4_N: IC4.C20(IO_L19N_T3_VREF_16) ; port EXT9.LVDS_4_N
EXT9.LVDS_4_P: IC4.D20(IO_L19P_T3_16) ; port EXT9.LVDS_4_P
EXT9.LVDS_5_N: IC4.D22(IO_L22N_T3_16) ; port EXT9.LVDS_5_N
EXT9.LVDS_5_P: IC4.E22(IO_L22P_T3_16) ; port EXT9.LVDS_5_P
EXT9.LVDS_6_N: IC4.B22(IO_L20N_T3_16) ; port EXT9.LVDS_6_N
EXT9.LVDS_6_P: IC4.C22(IO_L20P_T3_16) ; port EXT9.LVDS_6_P
EXT9.LVDS_7_N: IC4.D21(IO_L23N_T3_16) ; port EXT9.LVDS_7_N
EXT9.LVDS_7_P: IC4.E21(IO_L23P_T3_16) ; port EXT9.LVDS_7_P
EXT10.LVDS_0_N: IC4.V14(IO_L13N_T2_MRCC_13) ; port EXT10.LVDS_0_N
EXT10.LVDS_0_P: IC4.V13(IO_L13P_T2_MRCC_13) ; port EXT10.LVDS_0_P
EXT10.LVDS_1_N: IC4.AA16(IO_L1N_T0_13) ; port EXT10.LVDS_1_N
EXT10.LVDS_1_P: IC4.Y16(IO_L1P_T0_13) ; port EXT10.LVDS_1_P
EXT10.LVDS_2_N: IC4.AB17(IO_L2N_T0_13) ; port EXT10.LVDS_2_N
EXT10.LVDS_2_P: IC4.AB16(IO_L2P_T0_13) ; port EXT10.LVDS_2_P
EXT10.LVDS_3_N: IC4.AB13(IO_L3N_T0_DQS_13) ; port EXT10.LVDS_3_N
EXT10.LVDS_3_P: IC4.AA13(IO_L3P_T0_DQS_13) ; port EXT10.LVDS_3_P
EXT10.LVDS_4_N: IC4.AA14(IO_L5N_T0_13) ; port EXT10.LVDS_4_N
EXT10.LVDS_4_P: IC4.Y13(IO_L5P_T0_13) ; port EXT10.LVDS_4_P
EXT10.LVDS_5_N: IC4.AB15(IO_L4N_T0_13) ; port EXT10.LVDS_5_N
EXT10.LVDS_5_P: IC4.AA15(IO_L4P_T0_13) ; port EXT10.LVDS_5_P
EXT10.LVDS_6_N: IC4.W16(IO_L16N_T2_13) ; port EXT10.LVDS_6_N
EXT10.LVDS_6_P: IC4.W15(IO_L16P_T2_13) ; port EXT10.LVDS_6_P
EXT10.LVDS_7_N: IC4.T15(IO_L15N_T2_DQS_13) ; port EXT10.LVDS_7_N
EXT10.LVDS_7_P: IC4.T14(IO_L15P_T2_DQS_13) ; port EXT10.LVDS_7_P
EXT11.LVDS_0_N: IC4.W12(IO_L12N_T1_MRCC_13) ; port EXT11.LVDS_0_N
EXT11.LVDS_0_P: IC4.W11(IO_L12P_T1_MRCC_13) ; port EXT11.LVDS_0_P
EXT11.LVDS_1_N: IC4.V15(IO_L14N_T2_SRCC_13) ; port EXT11.LVDS_1_N
EXT11.LVDS_1_P: IC4.U15(IO_L14P_T2_SRCC_13) ; port EXT11.LVDS_1_P
EXT11.LVDS_2_N: IC4.Y14(IO_L6N_T0_VREF_13) ; port EXT11.LVDS_2_N
EXT11.LVDS_2_P: IC4.W14(IO_L6P_T0_13) ; port EXT11.LVDS_2_P
EXT11.LVDS_3_N: IC4.W10(IO_L10N_T1_13) ; port EXT11.LVDS_3_N
EXT11.LVDS_3_P: IC4.V10(IO_L10P_T1_13) ; port EXT11.LVDS_3_P
EXT11.LVDS_4_N: IC4.Y12(IO_L11N_T1_SRCC_13) ; port EXT11.LVDS_4_N
EXT11.LVDS_4_P: IC4.Y11(IO_L11P_T1_SRCC_13) ; port EXT11.LVDS_4_P
EXT11.LVDS_5_N: IC4.AB12(IO_L7N_T1_13) ; port EXT11.LVDS_5_N
EXT11.LVDS_5_P: IC4.AB11(IO_L7P_T1_13) ; port EXT11.LVDS_5_P
EXT11.LVDS_6_N: IC4.AA11(IO_L9N_T1_DQS_13) ; port EXT11.LVDS_6_N
EXT11.LVDS_6_P: IC4.AA10(IO_L9P_T1_DQS_13) ; port EXT11.LVDS_6_P
EXT11.LVDS_7_N: IC4.AB10(IO_L8N_T1_13) ; port EXT11.LVDS_7_N
EXT11.LVDS_7_P: IC4.AA9(IO_L8P_T1_13) ; port EXT11.LVDS_7_P
I2C_SW_SCL: IC4.J16(IO_0_15) ; port I2C_SW_SCL
I2C_SW_SDA: IC4.F15(IO_0_16) ; port I2C_SW_SDA
LED_USER1: IC4.N17(IO_L21P_T3_DQS_14) R45.2 T3.1(G)
LED_USER2: IC4.V22(IO_L3N_T0_DQS_EMCCLK_14) R19.2 T2.1(G)
LED_USER3: IC4.T21(IO_L4P_T0_D04_14) R23.2 T12.1(G)
RxD_2V5: IC4.T16(IO_L17P_T2_13) ; port RxD_2V5
SFP_0.LED: IC4.U16(IO_L17N_T2_13)
SFP_0.LOS: IC4.N15(IO_25_14)
SFP_0.MOD_PRESENT: IC4.P16(IO_L24P_T3_A01_D17_14)
SFP_0.RATE_SELECT: IC4.R14(IO_L19N_T3_A09_D25_VREF_14)
SFP_0.RATE_SELECT1: IC4.P15(IO_L22P_T3_A05_D21_14)
SFP_0.TX_DISABLE: IC4.N14(IO_L23N_T3_A02_D18_14)
SFP_0.TX_FAULT: IC4.U7(IO_25_34)
SFP_1.LED: IC4.R19(IO_L5N_T0_D07_14)
SFP_1.LOS: IC4.T18(IO_L20N_T3_A07_D23_14)
SFP_1.MOD_PRESENT: IC4.P17(IO_L21N_T3_DQS_A06_D22_14)
SFP_1.RATE_SELECT: IC4.U18(IO_L18N_T2_A11_D27_14)
SFP_1.RATE_SELECT1: IC4.R18(IO_L20P_T3_A08_D24_14)
SFP_1.TX_DISABLE: IC4.R17(IO_L24N_T3_A00_D16_14)
SFP_1.TX_FAULT: IC4.U17(IO_L18P_T2_A12_D28_14)
SFP_2.LED: IC4.W20(IO_L12N_T1_MRCC_14)
SFP_2.LOS: IC4.R16(IO_L22N_T3_A04_D20_14)
SFP_2.MOD_PRESENT: IC4.T20(IO_L6N_T0_D08_VREF_14)
SFP_2.RATE_SELECT: IC4.P14(IO_L19P_T3_A10_D26_14)
SFP_2.RATE_SELECT1: IC4.U21(IO_L4N_T0_D05_14)
SFP_2.TX_DISABLE: IC4.P20(IO_0_14)
SFP_2.TX_FAULT: IC4.P19(IO_L5P_T0_D06_14)
TxD_2V5: IC4.M17(IO_25_15) ; port TxD_2V5
NetLD2_1: LD2.1(A) R44.1
NetLD2_2: LD2.2(C) T3.3(D)
NetLD13_1: LD13.1(A) R11.1
NetLD13_2: LD13.2(C) T2.3(D)
NetLD14_1: LD14.1(A) R20.1
NetLD14_2: LD14.2(C) T12.3(D)

Not connected (* = marked no-connect by the designer): IC4 F21(IO_25_16) T3(IO_0_34) W19(IO_L12P_T1_MRCC_14)* Y17(IO_0_13)

### Buses and harness runs
harness EXT0 = port EXT0
harness EXT1 = port EXT1
harness EXT2 = port EXT2
harness EXT3 = port EXT3
harness EXT4 = port EXT4
harness EXT5 = port EXT5
harness EXT6 = port EXT6
harness EXT7 = port EXT7
harness EXT8 = port EXT8
harness EXT9 = port EXT9
harness EXT10 = port EXT10
harness EXT11 = port EXT11
harness SFP_0 = port SFP_0
harness SFP_1 = port SFP_1
harness SFP_2 = port SFP_2

### Layout directives
differential pair: CK_FPGAIO_N, CK_FPGAIO_P, CLKREC_N, CLKREC_P, EXT0.LVDS_0_N, EXT0.LVDS_1_N, EXT0.LVDS_1_P, EXT0.LVDS_2_N, EXT0.LVDS_2_P, EXT0.LVDS_3_N, EXT0.LVDS_3_P, EXT0.LVDS_4_N, EXT0.LVDS_4_P, EXT0.LVDS_5_N, EXT0.LVDS_5_P, EXT0.LVDS_6_N, EXT0.LVDS_6_P, EXT0.LVDS_7_N, EXT0.LVDS_7_P, EXT1.LVDS_0_N, EXT1.LVDS_0_P, EXT1.LVDS_1_N, EXT1.LVDS_1_P, EXT1.LVDS_2_N, EXT1.LVDS_2_P, EXT1.LVDS_3_N, EXT1.LVDS_3_P, EXT1.LVDS_4_N, EXT1.LVDS_4_P, EXT1.LVDS_5_N, EXT1.LVDS_5_P, EXT1.LVDS_6_N, EXT1.LVDS_6_P, EXT1.LVDS_7_N, EXT1.LVDS_7_P, EXT2.LVDS_0_N, EXT2.LVDS_0_P, EXT2.LVDS_1_N, EXT2.LVDS_1_P, EXT2.LVDS_2_N, EXT2.LVDS_2_P, EXT2.LVDS_3_N, EXT2.LVDS_3_P, EXT2.LVDS_4_N, EXT2.LVDS_4_P, EXT2.LVDS_5_N, EXT2.LVDS_5_P, EXT2.LVDS_6_N, EXT2.LVDS_6_P, EXT2.LVDS_7_N, EXT2.LVDS_7_P, EXT3.LVDS_0_N, EXT3.LVDS_0_P, EXT3.LVDS_1_N, EXT3.LVDS_1_P, EXT3.LVDS_2_N, EXT3.LVDS_2_P, EXT3.LVDS_3_N, EXT3.LVDS_3_P, EXT3.LVDS_4_N, EXT3.LVDS_4_P, EXT3.LVDS_5_N, EXT3.LVDS_5_P, EXT3.LVDS_6_N, EXT3.LVDS_6_P, EXT3.LVDS_7_N, EXT3.LVDS_7_P, EXT4.LVDS_0_N, EXT4.LVDS_0_P, EXT4.LVDS_1_N, EXT4.LVDS_1_P, EXT4.LVDS_2_N, EXT4.LVDS_2_P, EXT4.LVDS_3_N, EXT4.LVDS_3_P, EXT4.LVDS_4_N, EXT4.LVDS_4_P, EXT4.LVDS_5_N, EXT4.LVDS_5_P, EXT4.LVDS_6_N, EXT4.LVDS_6_P, EXT4.LVDS_7_N, EXT4.LVDS_7_P, EXT5.LVDS_0_N, EXT5.LVDS_0_P, EXT5.LVDS_1_N, EXT5.LVDS_1_P, EXT5.LVDS_2_N, EXT5.LVDS_2_P, EXT5.LVDS_3_N, EXT5.LVDS_3_P, EXT5.LVDS_4_N, EXT5.LVDS_4_P, EXT5.LVDS_5_N, EXT5.LVDS_5_P, EXT5.LVDS_6_N, EXT5.LVDS_6_P, EXT5.LVDS_7_N, EXT5.LVDS_7_P, EXT6.LVDS_0_N, EXT6.LVDS_0_P, EXT6.LVDS_1_N, EXT6.LVDS_1_P, EXT6.LVDS_2_N, EXT6.LVDS_2_P, EXT6.LVDS_3_N, EXT6.LVDS_3_P, EXT6.LVDS_4_N, EXT6.LVDS_4_P, EXT6.LVDS_5_N, EXT6.LVDS_5_P, EXT6.LVDS_6_N, EXT6.LVDS_6_P, EXT6.LVDS_7_N, EXT6.LVDS_7_P, EXT7.LVDS_0_N, EXT7.LVDS_0_P, EXT7.LVDS_1_N, EXT7.LVDS_1_P, EXT7.LVDS_2_N, EXT7.LVDS_2_P, EXT7.LVDS_3_N, EXT7.LVDS_3_P, EXT7.LVDS_4_N, EXT7.LVDS_4_P, EXT7.LVDS_5_N, EXT7.LVDS_5_P, EXT7.LVDS_6_N, EXT7.LVDS_6_P, EXT7.LVDS_7_N, EXT7.LVDS_7_P, EXT8.LVDS_0_N, EXT8.LVDS_0_P, EXT8.LVDS_1_N, EXT8.LVDS_1_P, EXT8.LVDS_2_N, EXT8.LVDS_2_P, EXT8.LVDS_3_N, EXT8.LVDS_3_P, EXT8.LVDS_4_N, EXT8.LVDS_4_P, EXT8.LVDS_5_N, EXT8.LVDS_5_P, EXT8.LVDS_6_N, EXT8.LVDS_6_P, EXT8.LVDS_7_N, EXT8.LVDS_7_P, EXT9.LVDS_0_N, EXT9.LVDS_0_P, EXT9.LVDS_1_N, EXT9.LVDS_1_P, EXT9.LVDS_2_N, EXT9.LVDS_2_P, EXT9.LVDS_3_N, EXT9.LVDS_3_P, EXT9.LVDS_4_N, EXT9.LVDS_4_P, EXT9.LVDS_5_N, EXT9.LVDS_5_P, EXT9.LVDS_6_N, EXT9.LVDS_6_P, EXT9.LVDS_7_N, EXT9.LVDS_7_P, EXT10.LVDS_0_N, EXT10.LVDS_0_P, EXT10.LVDS_1_N, EXT10.LVDS_1_P, EXT10.LVDS_2_N, EXT10.LVDS_2_P, EXT10.LVDS_3_N, EXT10.LVDS_3_P, EXT10.LVDS_4_N, EXT10.LVDS_4_P, EXT10.LVDS_5_N, EXT10.LVDS_5_P, EXT10.LVDS_6_N, EXT10.LVDS_6_P, EXT10.LVDS_7_N, EXT10.LVDS_7_P, EXT11.LVDS_0_N, EXT11.LVDS_0_P, EXT11.LVDS_1_N, EXT11.LVDS_1_P, EXT11.LVDS_2_N, EXT11.LVDS_2_P, EXT11.LVDS_3_N, EXT11.LVDS_3_P, EXT11.LVDS_4_N, EXT11.LVDS_4_P, EXT11.LVDS_5_N, EXT11.LVDS_5_P, EXT11.LVDS_6_N, EXT11.LVDS_6_P, EXT11.LVDS_7_N, EXT11.LVDS_7_P
differential pair; net class Diff_100Ohm: EXT0.LVDS_0_P

### Notes on the sheet
- All LVDS_0 lines are capable of clock input.
- (near R43) DNP
- Project/Equipment
- Document
- Designer
- Drawn by
- Check.by
- File
- Last Mod.
- Print Date
- Sheet
- Size
- A3
- of
- Rev
- (in symbol CMP-0364-00026-3, part A) BANK 13
- (in symbol CMP-0364-00026-3, part B) BANK 14
- (in symbol CMP-0364-00026-3, part C) BANK 15
- (in symbol CMP-0364-00026-3, part D) BANK 16
- (in symbol CMP-0364-00026-3, part E) BANK 34
- (in symbol KINGBRIGHT_KPTR-3216CGCK) Green
- (in symbol R0402_1k_1%_0.0625W_100PPM) 1%
- (in symbol R0402_1K_1%_0.0625W_100PPM) 1%
- (in symbol R0402_2K2_1%_0.0625W_100PPM) 1%

### Library data of the parts
IC4 = CMP-0364-00026-3: Artix-7 FPGA, 285 User I/Os, 4 GTP, 484-Ball BGA, Speed Grade 2, Commercial Grade, Pb-Free; Manufacturer: Xilinx; Max User I/O: 300; Clock Mgmt Tiles (CMTs): 6; Logic Cells: 101440; Block RAM Blocks (36Kb): 135; Block RAM Blocks (18Kb): 270; Speed Grade: -2; CLBs (Slices): 15850; Block RAM Blocks (Max Kb): 4860; DSP48E1 Slices: 240; RoHS: Pb-Free; ComponentLink3URL: http://www.xilinx.com/support/documentation/data_sheets/ds181_Artix_7_Data_Sheet.pdf; NexusDeviceID: XC7A100T-2FGG484C; DatasheetVersion: v1.12; Mounting Technology: Surface Mount; PackageDescription: Wire-Bond Fine-Pitch BGA, Body 23 x 23 mm, 1.0 mm Pitch; PackageReference: FGG484; ComponentLink2Description: Package Specification; Code_JEDEC: MS-034-AAJ-1; ComponentLink2URL: http://www.xilinx.com/support/documentation/user_guides/ug475_7Series_Pkg_Pinout.pdf; ComponentLink3Description: DC and Switching Characteristics; Generic Part Number: XC7A100T; ComponentLink4Description: Package File; ComponentLink4URL: http://www.xilinx.com/support/packagefiles/a7packages/xc7a100tfgg484pkg.txt; ComponentLink1URL: http://www.xilinx.com/support/documentation/data_sheets/ds180_7Series_Overview.pdf; PartNumber: XC7A100T-2FGG484C; ComponentLink5URL: http://www.xilinx.com/support/documentation/user_guides/ug475_7Series_Pkg_Pinout.pdf; PackageVersion: Rev 1.8; ComponentLink5Description: Packaging and Pinout; ComponentLink1Description: Datasheet; CLBs (Max Distributed RAM Kb): 1188; ClassName: Artix
LD2 LD13 LD14 = KINGBRIGHT_KPTR-3216CGCK: LED Green 1A 2C; Manufacturer Part Number: KPH-1608CGCK; ComponentHeight: 0.65mm; HelpURL: http://datasheet.octopart.com/KPH-1608CGCK-Kingbright-datasheet-62316526.pdf; Package Description: SMT Green LED, Case 0603, Body L 1.6 x W 0.8mm H 0.65mm
R11 R20 R44 = R0402_1k_1%_0.0625W_100PPM: Resistor - 1%; Part Description: General Purpose Thick Film Chip Resistor; Manufacturer: GENERIC; Manufacturer1 Part Number: 232270671002L; TC: ±100ppm/°C; PressFit: No; Part Number: R0402_1K_1%_0.0625W_100PPM; Component Kind: Standard; Component Type: Standard; Pin Count: 2; Value: 1k; Status: Not Recommended; Power: 0.0625W; Tolerance: ±1%; Manufacturer Part Number: R0402_1K_1%_0.0625W_100PPM; Case: 0402; Mounted: Yes; Sense: No; Socket: No; SMD: Yes; Manufacturer1 Example: YAGEO PHYCOMP; Manufacturer1 ComponentHeight: 0.4mm; HelpURL: \\cern.ch\dfs\Applications\Altium\Datasheets\R0402_Phycomp_RC0402.pdf; Author: CERN DEM JLC; CreateDate: 03.12.2007; LatestRevisionDate: 17.10.2012; ClassName: Artix
R19 R23 R45 = R0402_2K2_1%_0.0625W_100PPM: as R94 on sheet TOP; Part Number: R0402_2K2_1%_0.0625W_100PPM; Component Kind: Standard; Component Type: Standard; Pin Count: 2; Value: 2k2; Status: Not Recommended; Power: 0.0625W; Tolerance: ±1%; Manufacturer Part Number: R0402_2K2_1%_0.0625W_100PPM; Case: 0402; Mounted: Yes; Sense: No; Socket: No; SMD: Yes; Manufacturer1 Example: YAGEO PHYCOMP; Manufacturer1 ComponentHeight: 0.4mm; HelpURL: \\cern.ch\dfs\Applications\Altium\Datasheets\R0402_Phycomp_RC0402.pdf; Author: CERN DEM JLC; CreateDate: 03.12.2007; LatestRevisionDate: 17.10.2012; ClassName: Artix
R42 R43 = R0402_1K_1%_0.0625W_100PPM: Resistor - 1%; Part Description: General Purpose Thick Film Chip Resistor; Manufacturer: GENERIC; Manufacturer1 Part Number: 232270671002L; TC: ±100ppm/°C; PressFit: No; Part Number: R0402_1K_1%_0.0625W_100PPM; Component Kind: Standard; Component Type: Standard; Pin Count: 2; Value: 1k; Status: Not Recommended; Power: 0.0625W; Tolerance: ±1%; Manufacturer Part Number: R0402_1K_1%_0.0625W_100PPM; Case: 0402; Mounted: Yes; Sense: No; Socket: No; SMD: Yes; Manufacturer1 Example: YAGEO PHYCOMP; Manufacturer1 ComponentHeight: 0.4mm; HelpURL: \\cern.ch\dfs\Applications\Altium\Datasheets\R0402_Phycomp_RC0402.pdf; Author: CERN DEM JLC; CreateDate: 03.12.2007; LatestRevisionDate: 17.10.2012; ClassName: Artix
T2 T3 T12 = BSH103: N-CHANNEL MOSFET WITH DIODE; Part Description: 30V 850mA N-Channel Enhancement Mode Field-Effect Transistor; Manufacturer: NEXPERIA; PressFit: No; Bonding: No; Part Number: BSH103; Component Kind: Standard; Component Type: Standard; Device: BSH103; PackageDescription: SOT23, 3 pin, Pitch 0.95mm - 1.3mm W X 2.9mm L X 1.1mm H, IPC Medium Density; Manufacturer Part Number: BSH103; Pin Count: 3; Case: SOT23-3; Mounted: Yes; Socket: No; SMD: Yes; Sense: No; ComponentHeight: 1.1mm; HelpURL: \\cern.ch\dfs\Applications\Altium\Datasheets\BSH103.pdf; Author: CERN DEM JLC; CreateDate: 16.03.2010; LatestRevisionDate: 20.06.2017; ClassName: Artix